# EAGLE design octanis_eps_v03 (EAGLE 7.1.0)
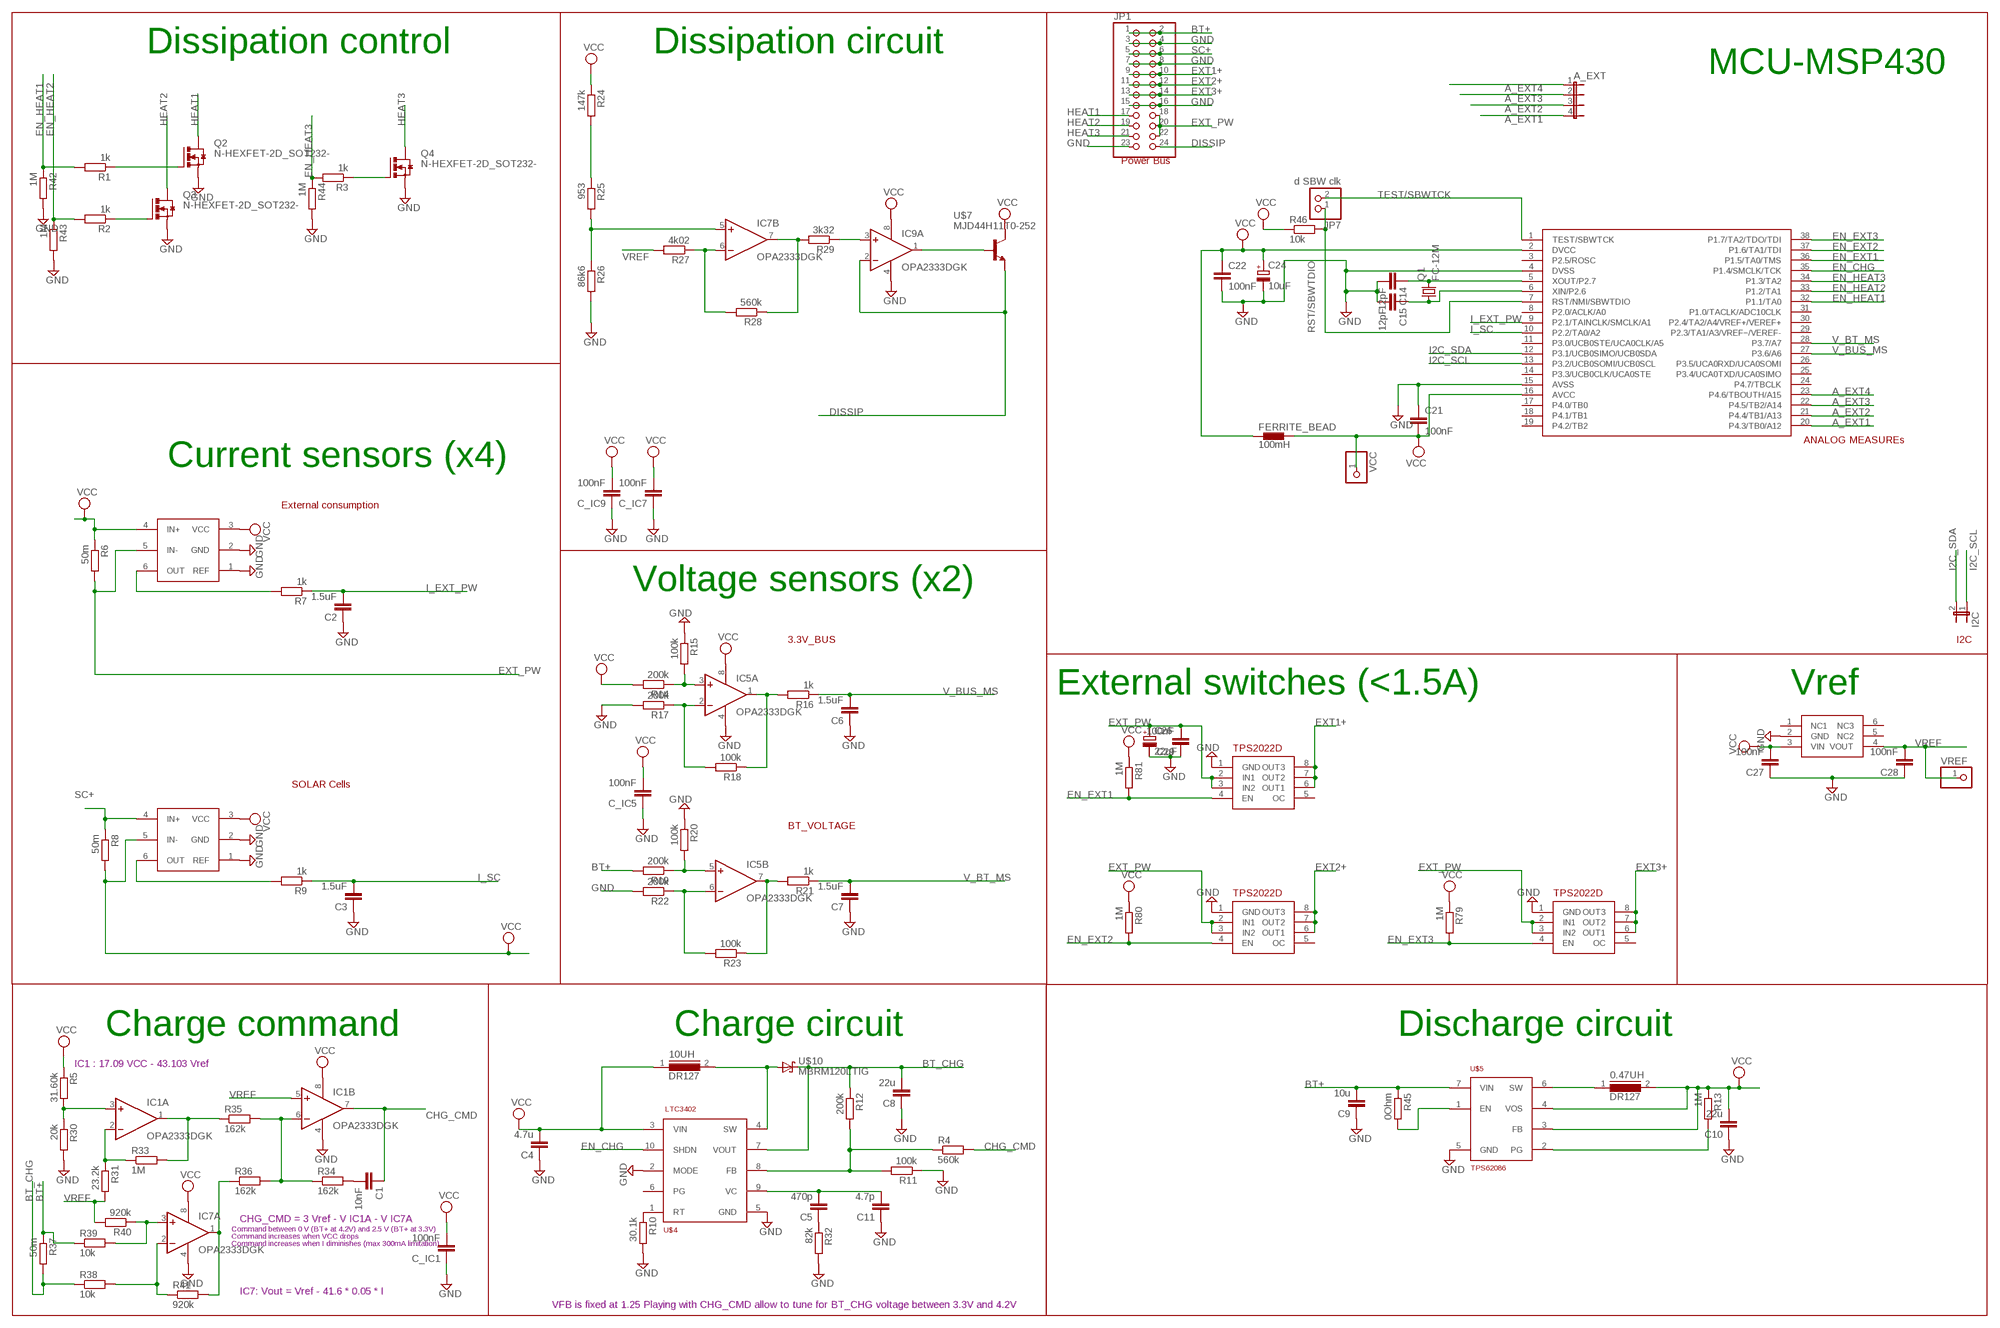
[diagram p0: schematic, sheet 1]

## Parts
0.47UH  DR127  [DR127]
10UH  DR127  [DR127]
A_EXT  JP4E  [JP4]
C1  10nF  C-EUC0603  [C0603]
C2  1.5uF  C-EUC0603  [C0603]
C3  1.5uF  C-EUC0603  [C0603]
C4  4.7u  C-EUC1206  [C1206]
C5  470p  C-EUC0603  [C0603]
C6  1.5uF  C-EUC0603  [C0603]
C7  1.5uF  C-EUC0603  [C0603]
C8  22u  C-EUC0603  [C0603]
C9  10u  C-EUC1206  [C1206]
C10  22u  C-EUC1206  [C1206]
C11  4.7p  C-EUC0603  [C0603]
C14  12pF  C-EUC0603  [C0603]
C15  12pF  C-EUC0603  [C0603]
C21  100nF  C-EUC0603  [C0603]
C22  100nF  C-EUC0603  [C0603]
C24  10uF  CPOL-EUA/3216-18R  [A/3216-18R]
C26  22uF  CPOL-EUA/3216-18R  [A/3216-18R]
C27  100nF  C-EUC0603  [C0603]
C28  100nF  C-EUC0603  [C0603]
C29  100nF  C-EUC0603  [C0603]
C_IC1  100nF  C-EUC0603  [C0603]
C_IC5  100nF  C-EUC0603  [C0603]
C_IC7  100nF  C-EUC0603  [C0603]
C_IC9  100nF  C-EUC0603  [C0603]
FERRITE_BEAD  100mH  BLM15HD601SN1  [0402]
I2C  JP1E  [JP1]
IC1  OPA2333DGK  [MSOP08]
IC5  OPA2333DGK  [MSOP08]
IC7  OPA2333DGK  [MSOP08]
IC9  OPA2333DGK  [MSOP08]
JP1  PINHD-2X12  [2X12]
JP7  d SBW clk  PINHD-1X2  [1X02]
Q1  FC-12M  [FC-12M]
Q2  N-HEXFET-2D_SOT232-  [SOT223]
Q3  N-HEXFET-2D_SOT232-  [SOT223]
Q4  N-HEXFET-2D_SOT232-  [SOT223]
R1  1k  R-EU_R0603  [R0603]
R2  1k  R-EU_R0603  [R0603]
R3  1k  R-EU_R0603  [R0603]
R4  560k  R-EU_R0603  [R0603]
R5  31.60k  R-EU_R0603  [R0603]
R6  50m  R-EU_R1206  [R1206]
R7  1k  R-EU_R0603  [R0603]
R8  50m  R-EU_R1206  [R1206]
R9  1k  R-EU_R0603  [R0603]
R10  30.1k  R-EU_R0603  [R0603]
R11  100k  R-EU_R0603  [R0603]
R12  200k  R-EU_R0603  [R0603]
R13  1M  R-EU_R0603  [R0603]
R14  200k  R-EU_R0603  [R0603]
R15  100k  R-EU_R0603  [R0603]
R16  1k  R-EU_R0603  [R0603]
R17  200k  R-EU_R0603  [R0603]
R18  100k  R-EU_R0603  [R0603]
R19  200k  R-EU_R0603  [R0603]
R20  100k  R-EU_R0603  [R0603]
R21  1k  R-EU_R0603  [R0603]
R22  200k  R-EU_R0603  [R0603]
R23  100k  R-EU_R0603  [R0603]
R24  147k  R-EU_R0603  [R0603]
R25  953  R-EU_R0603  [R0603]
R26  86k6  R-EU_R0603  [R0603]
R27  4k02  R-EU_R0603  [R0603]
R28  560k  R-EU_R0603  [R0603]
R29  3k32  R-EU_R0603  [R0603]
R30  20k  R-EU_R0603  [R0603]
R31  23.2k  R-EU_R0603  [R0603]
R32  82k  R-EU_R0603  [R0603]
R33  1M  R-EU_R0603  [R0603]
R34  162k  R-EU_R0603  [R0603]
R35  162k  R-EU_R0603  [R0603]
R36  162k  R-EU_R0603  [R0603]
R37  50m  R-EU_R1206  [R1206]
R38  10k  R-EU_R0603  [R0603]
R39  10k  R-EU_R0603  [R0603]
R40  920k  R-EU_R0603  [R0603]
R41  920k  R-EU_R0603  [R0603]
R42  1M  R-EU_R0603  [R0603]
R43  1M  R-EU_R0603  [R0603]
R44  1M  R-EU_R0603  [R0603]
R45  0Ohm  R-EU_R0603  [R0603]
R46  10k  R-EU_R0603  [R0603]
R79  1M  R-EU_R0603  [R0603]
R80  1M  R-EU_R0603  [R0603]
R81  1M  R-EU_R0603  [R0603]
U$2  INA213  [SC70-6]
U$3  INA213  [SC70-6]
U$4  LTC3402  [MSOP10]
U$5  TPS62086  [QFN-7]
U$6  MSP430G2544  [TSSOP38_MSPGXX44_SERIES]
U$7  MJD44H11T0-252  [TO252]
U$10  MBRM120LTIG  [DO216AA]
U$16  TPS2022D  [SO8]
U$17  TPS2022D  [SO8]
U$18  TPS2022D  [SO8]
U$19  ADR127B  [TSOT23-6]
VCC  PINHD-1X1  [1X01]
VREF  PINHD-1X1  [1X01]

## Nets
A_EXT1: A_EXT.4 U$6.20(P4.3/TB0/A12)
A_EXT2: A_EXT.3 U$6.21(P4.4/TB1/A13)
A_EXT3: A_EXT.2 U$6.22(P4.5/TB2/A14)
A_EXT4: A_EXT.1 U$6.23(P4.6/TBOUTH/A15)
BT+: C9.2 JP1.1 JP1.2 R19.2 R37.1 R39.1 R45.1 U$5.7(VIN)
BT_CHG: C8.2 R12.1 R37.2 R38.1 U$4.7(VOUT) U$10.C(K)
CHG_CMD: C1.1 IC1.7(B:OUT) R4.2
DISSIP: IC9.2(A:-IN) JP1.24 U$7.3(E)
EN_CHG: U$4.10(SHDN) U$6.35(P1.4/SMCLK/TCK)
EN_EXT1: R81.2 U$6.36(P1.5/TA0/TMS) U$16.4(EN)
EN_EXT2: R80.2 U$6.37(P1.6/TA1/TDI) U$17.4(EN)
EN_EXT3: R79.2 U$6.38(P1.7/TA2/TDO/TDI) U$18.4(EN)
EN_HEAT1: R1.2 R42.1 U$6.32(P1.1/TA0)
EN_HEAT2: R2.2 R43.1 U$6.33(P1.2/TA1)
EN_HEAT3: R3.2 R44.1 U$6.34(P1.3/TA2)
EXT1+: JP1.9 JP1.10 U$16.6(OUT1) U$16.7(OUT2) U$16.8(OUT3)
EXT2+: JP1.11 JP1.12 U$17.6(OUT1) U$17.7(OUT2) U$17.8(OUT3)
EXT3+: JP1.13 JP1.14 U$18.6(OUT1) U$18.7(OUT2) U$18.8(OUT3)
EXT_PW: C26.+ C29.2 JP1.18 JP1.20 JP1.22 R6.2 U$2.5(IN-) U$16.2(IN1) U$16.3(IN2) U$17.2(IN1) U$17.3(IN2) U$18.2(IN1) U$18.3(IN2)
GND: C2.1 C3.1 C4.1 C6.1 C7.1 C8.1 C9.1 C10.1 C11.1 C14.2 C15.2 C21.1 C22.2 C24.- C26.- C27.1 C28.1 C29.1 C_IC1.1 C_IC5.1 C_IC7.1 C_IC9.1 IC1.4(P:V-) IC5.4(P:V-) IC7.4(P:V-) IC9.4(P:V-) JP1.3 JP1.4 JP1.7 JP1.8 JP1.15 JP1.16 JP1.23 Q2.3(S) Q3.3(S) Q4.3(S) R10.2 R11.1 R15.1 R17.2 R20.1 R22.2 R26.2 R30.2 R32.2 R42.2 R43.2 R44.2 U$2.1(REF) U$2.2(GND) U$3.1(REF) U$3.2(GND) U$4.2(MODE) U$4.5(GND) U$5.5(GND) U$6.4(DVSS) U$6.15(AVSS) U$16.1(GND) U$17.1(GND) U$18.1(GND) U$19.2(GND)
HEAT1: JP1.17 Q2.2(D) Q2.4(D)
HEAT2: JP1.19 Q3.2(D) Q3.4(D)
HEAT3: JP1.21 Q4.2(D) Q4.4(D)
I2C_SCL: I2C.1 U$6.13(P3.2/UCB0SOMI/UCB0SCL)
I2C_SDA: I2C.2 U$6.12(P3.1/UCB0SIMO/UCB0SDA)
I_EXT_PW: C2.2 R7.1 U$6.9(P2.1/TAINCLK/SMCLK/A1)
I_SC: C3.2 R9.1 U$6.10(P2.2/TA0/A2)
N$1: R7.2 U$2.6(OUT)
N$2: R9.2 U$3.6(OUT)
N$3: R10.1 U$4.1(RT)
N$4: C5.1 R32.1
N$5: IC7.1(A:OUT) R36.1 R41.2
N$6: IC1.3(A:+IN) R5.2 R30.1
N$7: IC1.2(A:-IN) R31.1 R33.1
N$8: C5.2 C11.2 U$4.9(VC)
N$9: IC1.1(A:OUT) R33.2 R35.1
N$10: IC5.7(B:OUT) R21.2 R23.1
N$11: IC1.6(B:-IN) R34.1 R35.2 R36.2
N$12: IC5.1(A:OUT) R16.2 R18.1
N$13: IC5.2(A:-IN) R17.1 R18.2
N$14: IC5.3(A:+IN) R14.1 R15.2
N$15: IC5.6(B:-IN) R22.1 R23.2
N$16: IC5.5(B:+IN) R19.1 R20.2
N$17: IC7.2(A:-IN) R38.2 R41.1
N$18: R24.2 R25.1
N$19: IC7.5(B:+IN) R25.2 R26.1
N$20: IC7.6(B:-IN) R27.1 R28.2
N$21: IC7.7(B:OUT) R28.1 R29.2
N$22: IC9.3(A:+IN) R29.1
N$23: R4.1 R11.2 R12.2 U$4.8(FB)
N$24: 10UH.2 U$4.4(SW) U$10.A
N$25: R13.2 U$5.2(PG)
N$26: 0.47UH.1 U$5.6(SW)
N$27: C1.2 R34.2
N$28: IC7.3(A:+IN) R39.2 R40.1
N$29: Q2.1(G) R1.1
N$30: R45.2 U$5.1(EN)
N$31: Q3.1(G) R2.1
N$37: Q4.1(G) R3.1
N$45: IC9.1(A:OUT) U$7.1(B)
N$48: C14.1 Q1.2 U$6.5(XOUT/P2.7)
N$50: C15.1 Q1.1 U$6.6(XIN/P2.6)
RST/SBWTDIO: JP7.1 R46.2 U$6.7(RST/NMI/SBWTDIO)
SC+: JP1.5 JP1.6 R8.1 U$3.4(IN+)
TEST/SBWTCK: JP7.2 U$6.1(TEST/SBWTCK)
V_BT_MS: C7.2 R21.1 U$6.28(P3.7/A7)
V_BUS_MS: C6.2 R16.1 U$6.27(P3.6/A6)
VCC: 0.47UH.2 10UH.1 C4.2 C10.2 C21.2 C22.1 C24.+ C27.2 C_IC1.2 C_IC5.2 C_IC7.2 C_IC9.2 FERRITE_BEAD.1 FERRITE_BEAD.2 IC1.8(P:V+) IC5.8(P:V+) IC7.8(P:V+) IC9.8(P:V+) R5.1 R6.1 R8.2 R13.1 R14.2 R24.1 R46.1 R79.1 R80.1 R81.1 U$2.3(VCC) U$2.4(IN+) U$3.3(VCC) U$3.5(IN-) U$4.3(VIN) U$5.3(FB) U$5.4(VOS) U$6.2(DVCC) U$6.16(AVCC) U$7.2(C) U$19.3(VIN) VCC.1
VREF: C28.2 IC1.5(B:+IN) R27.2 R31.2 R40.2 U$19.4(VOUT) VREF.1
Unconnected: IC9.5(B:+IN) IC9.6(B:-IN) IC9.7(B:OUT) U$4.6(PG) U$6.3(P2.5/ROSC) U$6.8(P2.0/ACLK/A0) U$6.11(P3.0/UCB0STE/UCA0CLK/A5) U$6.14(P3.3/UCB0CLK/UCA0STE) U$6.17(P4.0/TB0) U$6.18(P4.1/TB1) U$6.19(P4.2/TB2) U$6.24(P4.7/TBCLK) U$6.25(P3.4/UCA0TXD/UCA0SIMO) U$6.26(P3.5/UCA0RXD/UCA0SOMI) U$6.29(P2.3/TA1/A3/VREF−/VEREF-) U$6.30(P2.4/TA2/A4/VREF+/VEREF+) U$6.31(P1.0/TACLK/ADC10CLK) U$16.5(OC) U$17.5(OC) U$18.5(OC) U$19.1(NC1) U$19.5(NC2) U$19.6(NC3)

## Notes on the sheet
- Dissipation control | Dissipation circuit
- MCU-MSP430
- Power Bus
- ANALOG MEASUREs
- Current sensors (x4)
- External consumption
- Voltage sensors (x2)
- 3.3V_BUS | I2C
- External switches (<1.5A) | Vref
- SOLAR Cells
- BT_VOLTAGE
- Charge command | Charge circuit | Discharge circuit
- IC1 : 17.09 VCC - 43.103 Vref
- CHG_CMD = 3 Vref - V IC1A - V IC7A
- Command between 0 V (BT+ at 4.2V) and 2.5 V (BT+ at 3.3V)
- Command increases when VCC drops
- Command increases when I diminishes (max 300mA limitation)
- IC7: Vout = Vref - 41.6 * 0.05 * I
- VFB is fixed at 1.25 Playing with CHG_CMD allow to tune for BT_CHG voltage between 3.3V and 4.2V

## Library data of the parts
0.47UH 10UH = inductors:DR127: High Power Density, High Efficiency, Shielded Inductors Source: coiltronics_dr_series.pdf
A_EXT = jumper:JP4E: JUMPER
C1-C11 C14 C15 C21 C22 C27-C29 C_IC1 C_IC5 C_IC7 C_IC9 = rcl:C-EU: CAPACITOR, European symbol
C24 C26 = rcl:CPOL-EU: POLARIZED CAPACITOR, European symbol
FERRITE_BEAD = inductors:BLM15H: EMIFIL (R) Chip Ferrite Bead for GHz Noise Source: http://www.murata.com/ Ferrite Bead BLM15H.pdf
I2C = jumper:JP1E: JUMPER
IC1 IC5 IC7 IC9 = linear:OPA2333: DUAL 1.8V, microPOWER CMOS OPERATIONAL AMPLIFIERS Zerø-Drift Series Source: Texas Instruments (Burr-Brown) .. U11 opa333 Operational Amp.pdf
JP1 = pinhead:PINHD-2X12: PIN HEADER
JP7 = pinhead:PINHD-1X2: PIN HEADER
Q1 = crystal:FC-12M: kHz RANGE CRYSTAL UNIT LOW PROFILE SMD Source: Epson Toyocom FC-12M.pdf
Q2-Q4 = transistor-power:N-HEXFET-2D_?-*: HEXFET® Power MOSFET 2 Drain connects http://www.irf.com/product-info/datasheets/data/irll014n.pdf
R1-R46 R79-R81 = rcl:R-EU_: RESISTOR, European symbol
U$2 U$3 = Octanis1_EPS:INA213: Voltage Output, High or Low Side Measurement, Bi-Directional Zer ø -Drift Series Current-Shunt Monitor
U$4 = Octanis1_EPS:LTC3402: 1 LTC3402 3402fb 2A, 3MHz Micropower Synchronous Boost Converter
U$5 = Octanis1_EPS:TPS62086: 3-A Step-Down Converter with Hiccup Short Circuit Protection in 2x2 QFN Package Fixed 3.3V operation
U$6 = Octanis1_EPS:MSP430G2544: MSP430G2x44 Mixed-Signal Microcontrollers
U$7 = Octanis1_EPS:MJD44H11: MJD44H11, MJD45H11 Complementary power transistors
U$10 = Octanis1_EPS:MBRM120LTIG
U$16-U$18 = Octanis1_EPS:TPS2022D: TEXAS INSTRUMENTS - TPS2022D - IC, 1.5A PWR DIST SWITCH 8SOIC
U$19 = Octanis1_EPS:ADR127B: ANALOG DEVICES - ADR127BUJZ-REEL7 - VOLTAGE REFERENCE, SERIES, 3.3V, TSOT-6
VCC VREF = pinhead:PINHD-1X1: PIN HEADER

## Net classes
0 default: clearance 0.205 mm

## Board
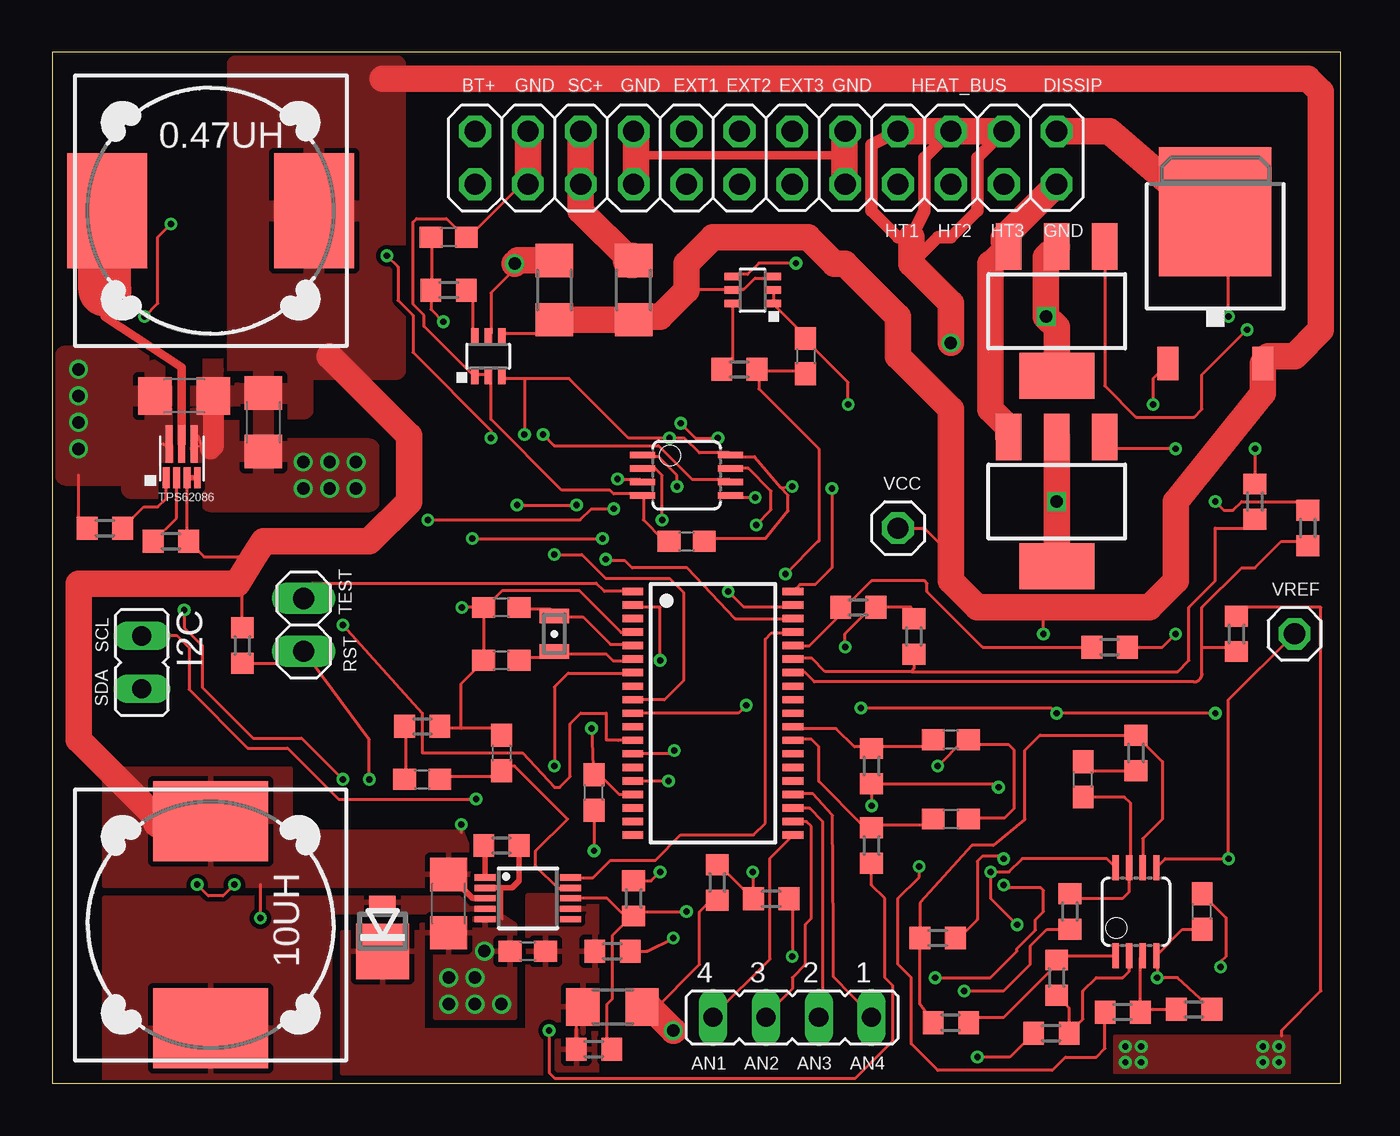
[diagram p1: board, top side]
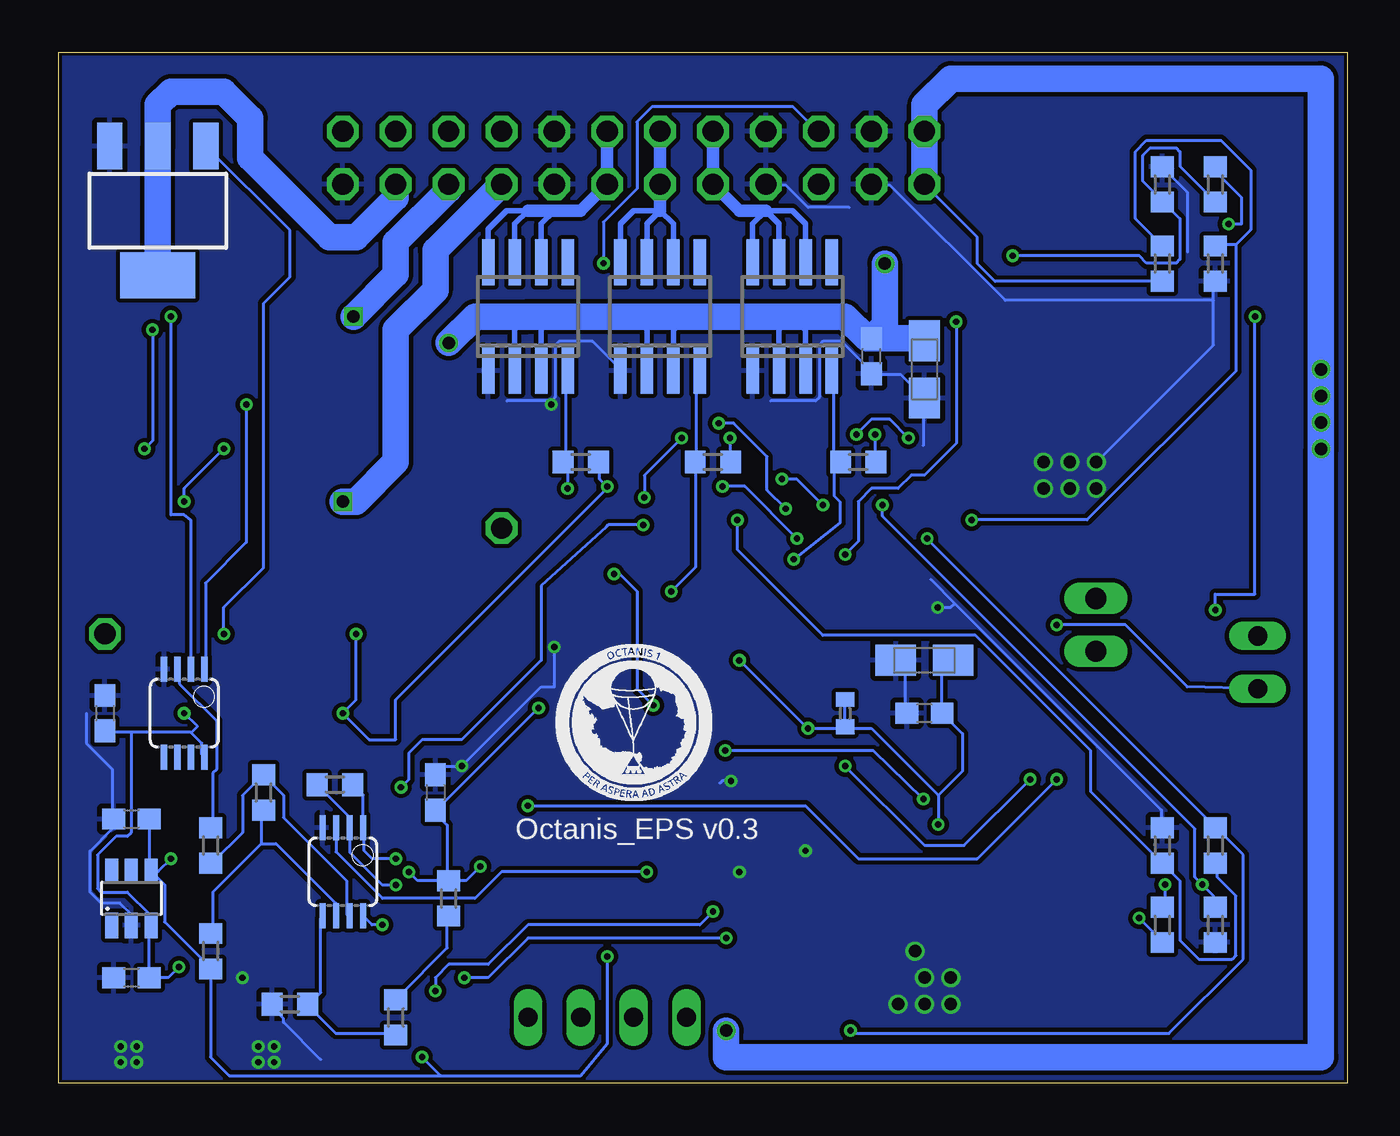
[diagram p2: board, bottom side, seen from below]

Size 61.9 x 49.52 mm. Coordinates in mm from the lower left corner, seen from the top.
Outline: 0,0 61.9,0 61.9,49.52 0,49.52 0,0
Copper layers (1*2*15*16): Top 0.035mm / dielectric 0.2mm / layer 2 0.0175mm / dielectric 1.1mm / layer 15 0.0175mm / dielectric 0.2mm / Bottom 0.035mm
Design rules "SeeedStudio_DRU_no_angle_20130527 *": minimum track width 6mil, minimum drill 12mil, track to track 6mil, track to pad 6mil, pad to pad 6mil, via to via 6mil, smd to smd 0mil, copper to edge 6mil, drill to drill 6mil, minimum pad ring 6mil, minimum via ring 6mil, stop-mask expansion 2mil, vias tented up to drill 25mil, thermal gap 10mil

### Footprints (pad centres in the part's own frame; a part is rotated, then mirrored left to right if it is on the bottom)
DR127 = smd 3.85 x 5.5: 1 -4.975,0; 2 4.975,0
JP4 = drill 0.914 long: 1 -3.81,0; 2 -1.27,0; 3 1.27,0; 4 3.81,0
C0603 = smd 1.1 x 1: 1 -0.85,0; 2 0.85,0
C1206 = smd 1.6 x 1.8: 1 -1.4,0; 2 1.4,0
A/3216-18R = smd 1.95 x 1.5: + 1.375,0; - -1.375,0
0402 = smd 0.7 x 0.9: 1 -0.65,0; 2 0.65,0
JP1 = drill 0.914 long: 1 0,-1.27; 2 0,1.27
MSOP08 = smd 0.3 x 1.2: 1 -0.976,-2.113; 2 -0.326,-2.113; 3 0.324,-2.113; 4 0.974,-2.113; 5 0.974,2.112; 6 0.324,2.112; 7 -0.326,2.112; 8 -0.976,2.112
2X12 = drill 1.016 octagon: 1 -13.97,-1.27; 2 -13.97,1.27; 3 -11.43,-1.27; 4 -11.43,1.27; 5 -8.89,-1.27; 6 -8.89,1.27; 7 -6.35,-1.27; 8 -6.35,1.27; 9 -3.81,-1.27; 10 -3.81,1.27; 11 -1.27,-1.27; 12 -1.27,1.27; 13 1.27,-1.27; 14 1.27,1.27; 15 3.81,-1.27; 16 3.81,1.27; 17 6.35,-1.27; 18 6.35,1.27; 19 8.89,-1.27; 20 8.89,1.27; 21 11.43,-1.27; 22 11.43,1.27; 23 13.97,-1.27; 24 13.97,1.27
1X02 = drill 1.016 long: 1 -1.27,0; 2 1.27,0
FC-12M = smd 0.7 x 1.4: 1 -0.85,0; 2 0.85,0
SOT223 = smd 1.219 x 2.235: 1 -2.311,-3.099; 2 0,-3.099; 3 2.311,-3.099 | smd 3.6 x 2.2: 4 0,3.099
R0603 = smd 1 x 1.1: 1 -0.85,0; 2 0.85,0
R1206 = smd 1.6 x 1.803: 1 -1.422,0; 2 1.422,0
SC70-6 = smd 0.35 x 0.8: 1 -0.65,-0.95; 2 0,-0.95; 3 0.65,-0.95; 4 0.65,0.95; 5 0,0.95; 6 -0.65,0.95
MSOP10 = smd 0.3 x 1: 1 -1,-2.05; 2 -0.5,-2.05; 3 0,-2.05; 4 0.5,-2.05; 5 1,-2.05; 6 1,2.05; 7 0.5,2.05; 8 0,2.05; 9 -0.5,2.05; 10 -1,2.05
QFN-7 = smd 0.33 x 1.016: 1 1.501,0.127; 2 1.001,0.127; 3 0.5,0.127; 4 0,0.127 | smd 0.33 x 1.778: 5 0.15,-1.499; 6 0.749,-1.499; 7 1.349,-1.499
TSSOP38_MSPGXX44_SERIES = smd 0.35 x 1: 1 -5.85,-3.85; 2 -5.2,-3.85; 3 -4.55,-3.85; 4 -3.9,-3.85; 5 -3.25,-3.85; 6 -2.6,-3.85; 7 -1.95,-3.85; 8 -1.3,-3.85; 9 -0.65,-3.85; 10 0,-3.85; 11 0.65,-3.85; 12 1.3,-3.85; 13 1.95,-3.85; 14 2.6,-3.85; 15 3.25,-3.85; 16 3.9,-3.85; 17 4.55,-3.85; 18 5.2,-3.85; 19 5.85,-3.85; 20 5.85,3.85; 21 5.2,3.85; 22 4.55,3.85; 23 3.9,3.85; 24 3.25,3.85; 25 2.6,3.85; 26 1.95,3.85; 27 1.3,3.85; 28 0.65,3.85; 29 0,3.85; 30 -0.65,3.85; 31 -1.3,3.85; 32 -1.95,3.85; 33 -2.6,3.85; 34 -3.25,3.85; 35 -3.9,3.85; 36 -4.55,3.85; 37 -5.2,3.85; 38 -5.85,3.85
TO252 = smd 1 x 1.6: 1 -2.28,-4.8; 2 2.28,-4.8 | smd 5.4 x 6.2: 3 0,2.5
DO216AA = smd 0.635 x 1.27: A 2.349,0 | smd 2.667 x 2.54: C -0.01,0
SO8 = smd 0.6 x 2.2: 1 -1.905,-2.6; 2 -0.635,-2.6; 3 0.635,-2.6; 4 1.905,-2.6; 5 1.905,2.6; 6 0.635,2.6; 7 -0.635,2.6; 8 -1.905,2.6
TSOT23-6 = smd 0.62 x 1.22: 1 -0.95,-1.3; 2 0,-1.3; 3 0.95,-1.3; 4 0.95,1.3; 5 0,1.3; 6 -0.95,1.3
1X01 = drill 1.016 octagon: 1 0,0

### Placement (x,y rotation side)
0.47UH  7.62,41.91 0 top
10UH  7.62,7.62 270 top
A_EXT  35.56,3.18 180 top
C1  49.53,14.61 90 top
C2  19.05,40.64 180 top
C3  36.2,34.92 270 top
C4  19.05,8.64 90 top
C5  17.78,14.61 0 top
C6  43.18,12.7 180 top
C7  43.18,16.51 180 top
C8  22.86,6.35 0 top
C9  6.35,33.02 180 top
C10  10.16,31.75 90 top
C11  21.59,15.87 270 top
C14  21.59,22.86 180 top
C15  21.59,20.32 180 top
C21  26.04,13.97 90 top
C22  20.32,17.78 180 bottom
C24  20.32,20.32 0 bottom
C26  20.32,34.29 90 bottom
C27  58.42,5.08 0 bottom
C28  58.42,12.7 0 bottom
C29  22.86,34.92 90 bottom
C_IC1  55.24,8.25 90 top
C_IC5  30.48,26.04 0 top
C_IC7  43.81,13.97 270 bottom
C_IC9  59.69,17.78 270 bottom
FERRITE_BEAD  24.13,17.78 270 bottom
I2C  4.32,20.22 180 top
IC1  52.07,8.25 0 top
IC5  30.48,29.21 270 top
IC7  48.26,10.16 180 bottom
IC9  55.88,17.78 180 bottom
JP1  34.29,44.45 0 top
JP7  12.09,22.02 90 top
Q1  24.13,21.59 90 top
Q2  48.26,27.94 180 top
Q3  48.26,37.08 180 top
Q4  57.15,41.91 180 bottom
R1  60.33,26.67 270 top
R2  57.78,27.94 270 top
R3  50.8,20.96 180 top
R4  48.9,8.25 90 top
R5  51.44,3.43 0 top
R6  24.13,38.1 90 top
R7  19.05,38.1 0 top
R8  27.94,38.1 270 top
R9  33.02,34.29 180 top
R10  21.59,11.43 0 top
R11  27.94,8.89 270 top
R12  26.04,1.65 0 top
R13  5.71,26.04 180 top
R14  8.89,7.62 270 bottom
R15  6.35,7.62 90 bottom
R16  39.37,11.43 270 top
R17  8.89,11.43 90 bottom
R18  6.35,11.43 270 bottom
R19  8.89,39.37 270 bottom
R20  6.35,39.37 90 bottom
R21  39.37,15.24 270 top
R22  8.89,43.18 90 bottom
R23  6.35,43.18 270 bottom
R24  43.18,8.89 270 bottom
R25  45.72,3.18 270 bottom
R26  50.8,3.81 180 bottom
R27  54.61,6.35 270 bottom
R28  52.07,13.97 270 bottom
R29  54.61,11.43 270 bottom
R30  54.86,3.56 0 top
R31  48.01,2.41 180 top
R32  17.78,17.14 0 top
R33  48.26,5.08 90 top
R34  52.07,15.87 270 top
R35  43.18,2.92 180 top
R36  42.55,6.99 180 top
R37  26.92,3.68 180 top
R38  26.92,6.35 0 top
R39  31.95,9.65 90 top
R40  34.54,8.86 0 top
R41  48.64,14.35 0 bottom
R42  56.9,21.59 90 top
R43  41.4,21.46 90 top
R44  38.73,22.86 0 top
R45  2.54,26.67 0 top
R46  9.14,21.03 270 top
R79  36.83,29.85 180 bottom
R80  30.48,29.85 180 bottom
R81  23.5,29.85 180 bottom
U$2  20.95,34.92 0 top
U$3  33.66,38.1 90 top
U$4  22.86,8.89 270 top
U$5  6.99,29.21 180 top
U$6  31.75,17.78 270 top
U$7  55.88,39.37 0 top
U$10  15.88,6.35 90 top
U$16  26.67,36.83 0 bottom
U$17  33.02,36.83 0 bottom
U$18  39.37,36.83 0 bottom
U$19  58.42,8.89 0 bottom
VCC  40.64,26.67 0 top
VREF  59.69,21.59 0 top

### Tracks (layer width: path | path; a pad name or v marks a point on that pad's centre or on a via)
A_EXT1
  Top 0.152: A_EXT.4 31.81,3.29 34.49,5.97 34.49,10.82 U$6.20
A_EXT2
  Top 0.152: A_EXT.3 34.31,3.29 35.56,4.54 35.56,5.08 36.2,5.71 36.2,7.64 36.47,7.93 36.47,12.34 36.25,12.57 U$6.21
A_EXT3
  Top 0.152: U$6.22 35.62,13.21 36.4,13.21 37.01,12.6 37.01,3.35 A_EXT.2
A_EXT4
  Top 0.152: A_EXT.1 39.31,3.29 37.53,5.13 37.53,7.25 37.49,12.88 36.55,13.92 35.64,13.92 U$6.23
BT+  (via drill 0.6)
  Top 0.152: 5.72,30.64 U$5.7 5.71,30.48 5.32,30.71 | R37.1 28.35,4.22 | R45.1 1.27,27.09 1.27,29.21 | 28.89,3.49 31.11,5.71 31.11,8.25 31.75,8.89 R39.1
  Top 1.27: v29.84,2.54 28.89,3.49 28.7,3.68 R37.1
  Bottom 0.152: R19.2 16.93,38.52 17.78,39.37 17.78,40.64 JP1.1
  Bottom 1.016: JP1.1 JP1.2
  Bottom 1.27: JP1.1 20.32,46.99 19.05,48.26 1.27,48.26 v1.27,33.02 v1.27,31.75 v1.27,30.48 1.27,1.27 29.84,1.27 v29.84,2.54
  other vias: 1.27,34.29
  pour Top: 0.64,29.21 3.81,29.21 3.81,28.57 5.71,28.57 5.71,33.66 4.45,34.92 0.64,34.92
BT_CHG
  Top 0.152: R12.1 25.18,3.37 R37.2
  pour Top: 13.97,7.24 17.78,7.24 17.78,2.54 22.86,2.54 22.86,9.02 26.16,9.02 26.16,0.51 13.97,0.51
CHG_CMD
  Top 0.152: C1.1 51.52,13.75 51.82,13.46 51.82,10.44 IC1.7 51.74,9.2 51.44,8.89 49.11,8.89 R4.2
DISSIP  (via drill 0.3)
  Top 0.152: v56.52,36.83 56.52,40 U$7.3
  Top 1.27: U$7.3 55.28,41.87 50.8,45.72 JP1.24
  Bottom 0.152: IC9.2 55.58,19.91 55.58,27.06 55.88,27.3 56.52,27.3 v56.52,36.83
EN_CHG
  Top 0.152: U$4.10 25.99,9.89 26.82,10.72 28.98,10.72 30.2,11.94 33.71,11.94 34.27,12.5 34.27,21.34 34.57,21.64 35.56,21.64 U$6.35
EN_EXT1  (via drill 0.3)
  Top 0.152: U$6.36 32.82,22.33 30.5,24.76 27.86,24.76 27.53,25.1 26.67,25.1 v26.59,25.17
  Bottom 0.152: 24.66,30.1 24.66,34.21 U$16.4 | 24.66,30.1 24.48,29.92 R81.2 | 24.66,30.1 24.66,28.22 24.38,27.94 24.38,26.92 v26.59,25.17
EN_EXT2  (via drill 0.3)
  Top 0.152: v32.49,23.62 33.22,22.89 35.51,22.89 U$6.37
  Bottom 0.152: U$17.4 31.27,34.21 31.27,29.92 R80.2 31.33,24.78 v32.49,23.62
EN_EXT3  (via drill 0.3)
  Top 0.152: v37.47,28.57 37.47,24.76 36.65,23.95 35.92,23.95 U$6.38
  Bottom 0.152: U$18.4 37.53,34.21 37.53,29.92 R79.2 37.47,29.85 v37.47,28.57
EN_HEAT1
  Top 0.152: 55.24,20.96 55.24,19.68 arc-90 54.84,19.28 36.62,19.28 36.17,19.74 U$6.32 | 55.24,20.96 55.24,22.86 57.15,24.76 57.78,24.76 59.05,26.04 60.11,26.04 R1.2 | 55.24,20.96 56.52,20.96 R42.1
EN_HEAT2
  Top 0.152: 41.27,19.78 54.07,19.78 54.61,20.32 54.61,22.86 55.88,24.13 55.88,26.67 57.37,26.67 R2.2 | R43.1 41.4,19.91 41.27,19.78 | 41.27,19.78 37.14,19.78 36.5,20.42 35.64,20.42 U$6.33
EN_HEAT3
  Top 0.152: R3.2 44.7,20.96 42.04,23.62 42.04,24 41.91,24.13 39.37,24.13 38.1,22.86 R44.1 37.88,22.52 36.37,21.01 35.62,21.01 U$6.34
EXT1+
  Bottom 0.254: U$16.7 27.3,41.27 27.94,41.91 | U$16.8 28.57,41.27 27.94,41.91 | U$16.6 26.04,41.27 26.67,41.91 27.94,41.91
  Bottom 0.61: JP1.10 JP1.9 29.21,41.91 27.94,41.91
EXT2+
  Bottom 0.254: U$17.6 32.38,41.27 33.02,41.91 | U$17.7 33.66,41.27 33.02,41.91 | U$17.8 34.92,41.27 34.29,41.91 33.02,41.91
  Bottom 0.61: JP1.12 JP1.11 33.02,41.91
EXT3+
  Bottom 0.254: U$18.6 38.73,41.27 38.1,41.91 | U$18.7 40.01,41.27 39.37,41.91 40.39,41.91 41.27,41.02 U$18.8
  Bottom 0.61: JP1.14 JP1.13 36.83,41.91 38.1,41.91 39.37,41.91
EXT_PW  (via drill 0.6)
  Top 0.152: U$2.5 21.09,36 21.09,37.96 21.98,38.86 v22.23,39.37
  Top 0.61: JP1.22 44.45,44.45 44.45,41.91 43.18,40.64 42.55,40.64 41.27,39.37 | JP1.20 41.91,44.45 41.91,41.91 41.27,40.64 40.64,40.64 39.37,41.91 39.37,45.08 JP1.18
  Top 1.27: R6.2 22.38,39.52 v22.23,39.37 | JP1.18 JP1.20 JP1.22 | 41.27,40.64 41.27,39.37 43.18,37.46 v43.18,35.56
  Bottom 0.254: U$16.3 26.04,36.19 26.67,36.83 27.3,36.19 U$16.2 | U$17.3 32.38,36.19 31.75,36.83 | U$17.2 33.66,36.19 34.29,36.83 | U$18.3 38.73,36.19 38.1,36.83 | U$18.2 40.01,36.19 39.37,36.83
  Bottom 1.27: C29.2 20.43,35.77 C26.+ | C29.2 23.07,35.77 24.13,36.83 26.67,36.83 31.75,36.83 34.29,36.83 38.1,36.83 39.37,36.83 41.91,36.83 v43.18,35.56 | v22.23,39.37 22.23,36.41 C29.2
GND  (via drill 0.3, 0.6)
  Top 0.152: 28.06,43.32 JP1.7 | 28.06,45.65 JP1.8 | 22.87,45.65 JP1.4 | 22.87,43.32 JP1.3 22.7,43.32 20.01,40.64 C2.1 19.84,40.64 18.94,41.54 17.51,41.54 17.33,41.36 17.33,37.43 17.87,36.89 17.87,36.35 20.19,34.03 U$2.1 20.37,34.03 20.91,34.03 U$2.2 21.09,33.85 21.09,31.89 24.48,28.49 26.8,28.49 26.98,28.31 28.23,28.31 IC5.4 28.41,28.13 28.41,27.06 29.31,26.17 29.48,26.17 C_IC5.1 29.66,25.99 29.84,25.81 | C14.2 20.73,22.77 20.73,20.45 C15.2 20.73,20.27 19.66,19.2 19.66,17.05 | 19.66,17.05 21.27,17.05 21.44,16.87 C11.1 | 19.66,17.05 18.76,17.05 R32.2 | C14.2 20.91,22.95 21.62,23.67 25.33,23.67 27.33,21.67 27.89,21.67 U$6.4 | 7.15,30.61 6.97,30.64 U$5.5 6.99,31.11 7.15,30.71 | 7.86,30.1 7.62,30.48 | C6.1 44.14,12.76 45.78,12.76 46.23,13.21 46.23,16 45.97,16.26 44.28,16.26 C7.1 43.81,16.51 v42.55,15.24 | 21.62,7.89 21.62,9.39 | U$3.2 34.67,37.96 34.67,37.6 U$3.1 34.67,37.43 36.28,35.82 C3.1 36.28,35.64 38.24,33.67 v38.24,32.6 | R11.1 27.88,9.73 28.78,9.73 v29.21,10.16 | C21.1 v26.04,11.18 | 55.24,7.62 C_IC1.1 54.31,7.4 IC1.4 53.09,6.1 v53.09,5.08 54.06,5.08 R30.2 | C14.2 v19.68,22.86 | R43.2 41.27,22.22 41.27,22.86 R44.2 39.37,22.86 38.1,21.59 v38.1,20.96 | R42.2 57.15,22.86 60.96,22.86 60.96,4.44 59.05,2.54 59.05,2.29 | U$6.15 v29.62,14.53
  Top 0.254: R10.2 22.44,9.74 22.09,9.39 21.62,9.39 U$4.2
  Top 0.406: 28.06,44.57 38.06,44.57
  Top 0.61: 38.06,44.45 38.06,44.2
  Top 1.016: C9.1 7.75,30.61 7.62,30.48
  Top 1.27: 38.06,45.65 38.06,44.57 38.06,44.2 38.06,43.32 | 28.06,45.65 28.06,44.57 28.06,43.32 | 22.87,43.32 22.87,45.65 | Q2.3 45.95,31.52 45.09,32.39 45.09,39.37 45.14,39.37 Q3.3 45.72,40.41 45.72,40.64 JP1.23
  Bottom 0.152: 23.95,42.07 25.91,42.07 26.98,43.14 27.88,43.14 JP1.7 | 22.87,43.14 JP1.3 22.7,43.14 21.98,43.14 16.44,37.6 6.43,37.6 | 7.68,39.93 7.68,42.79 8.76,43.86 R22.2 | 6.43,38.68 R20.1 6.43,38.5 6.43,37.6 | 20.37,30.64 20.37,32.78 C26.- 20.37,32.96 21.44,34.03 22.7,34.03 C29.1 22.87,34.21 24.3,35.64 25.2,35.64 25.38,35.46 25.38,32.96 25.55,32.78 27.7,32.78 | 14.65,29.92 v14.61,29.85 | 28.41,33.5 28.41,34.21 U$16.1 | 20.01,24.2 18.86,23.05 | 18.86,23.05 8.94,13.12 8.94,12.41 R17.2 | 6.43,37.6 6.43,35.46 11.97,29.92 v12.06,29.85 | 60.58,17.77 60.58,16.34 59.33,15.09 59.33,12.76 C28.1 59.33,12.59 59.33,12.23 60.4,11.16 60.4,9.19 59.86,8.65 58.97,8.65 58.44,8.12 58.44,7.76 U$19.2 | 59.86,18.48 C_IC9.1 | 41.1,33.5 41.1,34.21 U$18.1 | 38.24,32.78 40.39,32.78 | 38.24,32.78 38.06,32.96 38.06,35.46 37.88,35.64 36.28,35.64 35.02,34.39 U$17.1 | 38.24,32.78 v38.24,32.6 | 21.8,20.45 C24.- 21.62,20.27 21.27,19.91 21.27,17.95 C22.2 21.09,17.77 | 20.73,6.51 v20.78,6.35 | 49.32,1.15 51.11,2.94 51.11,3.12 51.64,3.65 R26.2 | 21.62,3.65 v21.59,3.81 | C_IC7.1 43.81,15.24 v42.55,15.24 38.73,19.05 38.1,19.05 v38.1,20.96 | v53.09,5.08 53.34,5.08 | v19.68,22.86 19.05,22.86 18.86,23.05 | v29.62,14.53 30.02,14.53 30.12,14.43 30.15,14.43
  other vias: 13.34,29.85 12.06,28.57 13.34,28.57 19.05,5.08 19.05,3.81 20.32,3.81 20.32,5.08 51.56,1.78 51.56,1.02 52.32,1.78 52.32,1.02 58.17,1.78 58.17,1.02 58.93,1.78 58.93,1.02 14.61,28.57
  pour Top: 6.35,34.29 7.62,27.94 15.24,27.94 15.24,30.48 11.43,30.48 11.43,34.29
  pour Top: 22.23,7.62 22.23,3.18 18.41,3.18 18.41,6.35 17.78,6.99 17.78,7.62 20.32,7.62 20.32,8.89
  pour Bottom: -1.27,49.53 63.5,49.53 62.23,-1.27 -1.27,-1.27
  pour Top: 51.56,2.29 59.44,2.29 59.44,2.03 59.44,0.51 51.05,0.51 51.05,1.27 51.05,2.29
HEAT1  (via drill 0.6)
  Top 1.27: Q2.2 v48.26,27.94 Q2.4
  Bottom 1.27: JP1.17 43.81,40 43.81,38.1 45.72,36.19 45.72,29.85 47.62,27.94 v48.26,27.94
HEAT2  (via drill 0.6)
  Top 1.27: Q3.2 47.75,39.67 v47.75,36.83 48.26,36.32 Q3.4
  Bottom 1.27: JP1.19 43.18,42.93 45.72,40.39 45.72,38.86 v47.75,36.83
HEAT3
  Bottom 1.27: JP1.21 45.72,42.55 47.62,40.64 48.9,40.64 52.7,44.45 52.7,46.35 53.98,47.62 56.52,47.62 57.15,46.99 Q4.2 Q4.4
I2C_SCL  (via drill 0.3)
  Top 0.152: v20.37,13.66 13.76,13.66 11.31,16.1 9.4,16.1 6.58,18.92 6.58,20.93 5.99,21.52 4.29,21.52 I2C.1 | v29.89,15.98 29.73,15.83 U$6.13
  Bottom 0.152: v20.37,13.66 22.77,15.98 v29.89,15.98
I2C_SDA  (via drill 0.3)
  Top 0.152: v13.97,22.02 17.78,17.78 17.78,15.87 22.61,15.87 24.13,14.22 24.38,14.22 24.89,14.73 24.89,17.27 25.4,17.78 26.62,17.78 26.62,16.49 27.21,16.48 U$6.12
  Bottom 0.152: I2C.2 7.7,19.05 10.67,22.02 v13.97,22.02
I_EXT_PW  (via drill 0.3)
  Top 0.152: C2.2 18.23,40.46 18.23,38.14 R7.1 18.2,37.17 v18.8,36.58 | v24.13,25.4 25.45,25.4 26.59,24.26 29.67,24.26 30.33,23.6 30.33,19.33 29.41,18.42 27.91,18.42 U$6.9
  Bottom 0.152: v18.8,36.58 18.8,30.73 20.32,29.21 20.95,29.21 21.59,28.57 22.86,28.57 23.5,27.94 23.5,26.04 v24.13,25.4
I_SC  (via drill 0.3)
  Top 0.152: 33.95,34.21 36.1,34.21 C3.2 | 33.95,34.21 R9.1 | 33.95,34.21 33.95,33.36 36.83,30.48 36.83,26.04 36.8,26.04 v35.23,24.46 | v33.35,18.16 32.97,17.78 U$6.10
  Bottom 0.152: v35.23,24.46 34.95,24.46 34.14,23.65 34.14,18.95 v33.35,18.16
N$1
  Top 0.152: U$2.6 20.19,36 20.19,37.78 20.01,37.96 R7.2
N$2
  Top 0.152: U$3.6 32.7,37.43 32.7,34.74 32.34,34.39 R9.2
N$3
  Top 0.254: U$4.1 20.81,11.36 R10.1
N$4
  Top 0.152: C5.1 16.98,14.73 16.98,17.05 R32.1
N$5  (via drill 0.3)
  Top 0.152: v45.72,10.79 45.59,10.92 44.7,10.92 44.45,10.67 44.45,7.87 43.56,6.99 R36.1
  Bottom 0.152: R41.2 47.28,13.84 IC7.1 47.24,12.23 47.24,11.18 46.86,10.79 v45.72,10.79
N$6
  Top 0.152: IC1.3 52.28,6.03 R5.2 52.67,3.56 R30.1
N$7
  Top 0.152: IC1.2 51.74,5.39 51.44,5.08 50.16,5.08 49.53,4.44 49.53,3.09 R31.1 48.86,3.63 R33.1
N$8
  Top 0.152: U$4.9 24.84,9.37 24.3,9.37 23.23,10.44 23.23,11.17 24.77,12.7 22.23,15.24 21.8,15.24 C11.2 | 21.62,14.91 C11.2 | C5.2 18.76,14.73 21.27,14.73 21.44,14.91 C11.2
N$9
  Top 0.152: IC1.1 48.47,6.14 R33.2 48.26,5.71 45.72,3.18 44.28,3.18 R35.1
N$10  (via drill 0.3)
  Top 0.152: v5.71,41.27 5.08,40.64 5.08,37.46 v4.45,36.83 | v39.37,13.33 R21.2 45.3,14.39 v45.47,14.22 | v33.83,26.82 34.54,27.56 34.54,28.45 33.46,29.54 IC5.7 | v6.35,22.73 6.35,21.89 7.21,21.03 7.21,19.03 9.65,16.59 11.99,16.59 v13.97,14.61
  Bottom 0.152: v5.71,41.27 5.08,41.27 5.08,42.55 6.35,43.81 R23.1 | v4.45,36.83 4.45,23.5 6.35,23.5 v6.35,22.73 | v13.97,14.61 17.78,10.79 23.5,10.79 26.04,13.33 v39.37,13.33 | v45.47,14.22 45.09,14.61 45.09,15.87 44.45,16.51 42.55,16.51 38.73,20.32 38.73,23.9 35.61,26.72 35.51,26.82 v33.83,26.82
N$11
  Top 0.152: IC1.6 52.39,11.75 53.34,12.7 53.34,15.46 R34.1 47.46,16.72 46.74,16 46.74,12.7 45.21,11.43 44.2,11.43 41.7,8.68 R36.2 41.7,3.81 R35.2
N$12  (via drill 0.3)
  Top 0.152: 39.49,10.44 R16.2 39.37,9.53 40.01,8.89 40.01,5.08 40.39,4.7 40.39,2.04 38.6,0.25 24.13,0.25 23.88,0.51 v23.88,2.54 | v30.02,28.67 30.02,29.21 29.13,30.1 28.41,30.1 IC5.1 | v20.19,26.17 v26.45,26.17
  Bottom 0.152: v30.02,28.67 28.95,28.67 v26.45,26.17 | v20.19,26.17 6.43,12.41 R18.1 6.25,12.23 5,10.98 5,5.97 8.58,2.4 23.76,2.4 v23.88,2.54
N$13  (via drill 0.3)
  Top 0.152: v29.31,27.06 29.31,29.21 28.95,29.56 28.41,29.56 IC5.2
  Bottom 0.152: R18.2 6.25,10.44 6.25,9.91 5.36,9.01 5.36,6.15 5.54,5.97 7.15,5.97 8.04,6.87 8.04,9.73 8.76,10.44 R17.1 8.94,10.62 12.33,14.02 12.33,15.98 17.87,21.52 25.2,21.52 29.31,25.63 v29.31,27.06
N$14  (via drill 0.3)
  Top 0.152: v6.97,9.55 7.5,9.01 8.22,9.01 v8.76,9.55 | v27.16,29.03 28.23,29.03 IC5.3 | v22.34,27.78 v25.2,27.78
  Bottom 0.152: v8.76,9.55 8.76,8.48 R14.1 | R15.2 6.43,8.48 6.43,9.01 v6.97,9.55 7.33,9.91 7.33,12.23 22.34,27.24 v22.34,27.78 | v27.16,29.03 26.45,29.03 v25.2,27.78
N$15  (via drill 0.3)
  Top 0.152: v23.59,31.17 24.12,30.64 29.13,30.64 30.74,29.03 32.52,29.03 IC5.6 | v21.09,30.99 21.09,31.35 17.33,35.1 17.33,36.89 16.62,37.6 16.62,39.21 v16.08,39.75
  Bottom 0.152: R23.2 6.43,42.43 8.04,44.04 8.04,44.75 8.22,44.93 9.47,44.93 9.83,44.57 9.83,43.32 8.94,42.43 R22.1 8.76,42.25 8.04,41.54 8.04,39.57 8.22,39.39 9.65,39.39 10.01,39.75 v16.08,39.75 | v23.59,31.17 22.87,31.89 21.98,31.89 v21.09,30.99
N$16  (via drill 0.3)
  Top 0.152: v33.77,28.13 32.7,28.13 IC5.5 | v31.99,30.99 30.91,30.99 v30.2,31.71 | v26.98,27.6 25.91,27.6 25.38,27.06 v18.05,27.06
  Bottom 0.152: 5.36,40.28 6.25,40.28 R20.2 | 5.36,40.28 4.65,41 4.65,43.86 6.08,45.29 9.65,45.29 10.19,44.75 10.19,41.54 8.94,40.28 R19.1 | v33.77,28.13 33.77,29.21 v31.99,30.99 | v30.2,31.71 29.48,31.71 27.88,30.1 27.88,28.49 v26.98,27.6 | v18.05,27.06 12.51,27.06 5.36,34.21 5.36,40.28
N$17  (via drill 0.3)
  Top 0.152: R38.2 28.57,6.35 v29.84,6.99 | v42.42,5.08 45.09,5.08 46.35,6.35 46.35,6.48 47.24,7.37 47.24,7.87 47.62,8.25 47.62,9.27 47.5,9.4 45.85,9.4 v45.72,9.53
  Bottom 0.152: R41.1 47.93,12.79 IC7.2 47.93,11.1 46.35,9.53 v45.72,9.53 | v29.84,6.99 39.37,6.99 41.27,5.08 v42.42,5.08
N$18
  Bottom 0.152: R24.2 43.24,7.94 43.24,6.51 45.57,4.19 R25.1
N$19
  Bottom 0.152: R25.2 45.75,2.4 48.61,2.4 49.86,3.65 R26.1 49.86,3.83 49.32,4.37 49.32,7.94 IC7.5
N$20
  Bottom 0.152: 52.18,11.51 54.5,9.19 54.5,7.23 R27.1 | 52.18,11.51 52.18,12.94 R28.2 | 52.18,11.51 51.47,11.51 48.61,8.65 48.61,8.12 IC7.6
N$21
  Bottom 0.152: R29.2 54.5,10.62 53.07,12.05 53.07,13.84 52.18,14.73 R28.1 52,14.73 51.11,13.84 51.11,12.76 48.07,9.73 48.07,8.12 IC7.7
N$22
  Bottom 0.152: R29.1 54.5,12.41 54.5,14.91 54.33,15.09 54.33,17.41 56.11,19.2 56.11,19.74 IC9.3
N$23  (via drill 0.3)
  Top 0.152: R11.2 27.52,8.04 26.67,8.89 U$4.8 | R12.2 26.67,1.87 26.67,3.81 26.92,4.06 26.92,7.11 27.85,8.04 R11.2 | R11.2 28.16,8.25 v30.48,8.25 | v43.81,4.44 45.72,4.44 46.99,5.71 46.99,6.6 47.79,7.4 R4.1
  Bottom 0.152: v30.48,8.25 31.11,7.62 39.37,7.62 41.27,5.71 43.18,5.71 43.81,5.08 v43.81,4.44
N$24
  Top 0.152: U$10.A 15.9,8.65 15.91,8.67
  pour Top: 21.59,8.89 2.54,8.89 2.54,0 13.34,0 13.34,8.25 21.59,8.25
N$25
  Top 0.152: R13.2 5.98,27.15 U$5.2
N$26
  Top 0.406: 2.54,38.1 2.54,36.83 6.24,34.4 U$5.6
  Top 2.54: 2.54,38.1 2.54,41.8 0.47UH.1
N$27
  Top 0.152: C1.2 49.96,15.03 R34.2
N$28  (via drill 0.3)
  Top 0.152: R39.2 32.09,10.44 R40.1 33.69,10.2 v33.66,10.16
  Bottom 0.152: v33.66,10.16 40.64,10.16 41.91,8.89 46.35,8.89 48.58,11.12 IC7.3
N$29  (via drill 0.3)
  Top 0.152: v55.88,27.94 56.3,27.52 56.73,27.52 57.15,27.94 59.91,27.94 R1.1 | v53.98,30.48 51.13,30.48 Q2.1
  Bottom 0.152: v55.88,27.94 55.88,28.57 v53.98,30.48
N$30
  Top 0.152: R45.2 4.41,27.69 5.08,27.69 5.48,28.09 U$5.1
N$31  (via drill 0.3)
  Top 0.152: Q3.1 50.57,33.5 52.07,32 54.86,32 55.24,32.39 55.24,34.04 v57.4,36.19 | v57.78,30.48 R2.1
  Bottom 0.152: v57.4,36.19 57.4,30.86 v57.78,30.48
N$37  (via drill 0.3)
  Top 0.152: R3.1 53.34,20.96 v53.98,21.59
  Bottom 0.152: v53.98,21.59 53.98,22.86 52.07,24.76 52.07,37.46 50.8,38.73 50.8,40.97 Q4.1
N$45  (via drill 0.3)
  Top 0.152: U$7.1 52.9,33.86 v52.9,32.6
  Bottom 0.152: v52.9,32.6 52.9,25.99 54.86,24.02 54.86,19.91 IC9.1
N$48
  Top 0.152: C14.1 22.52,22.77 23.95,22.77 24.12,22.59 Q1.2 24.3,22.42 25.15,22.4 25.5,22.4 26.82,21.08 27.85,21.08 U$6.5
N$50
  Top 0.152: C15.1 22.52,20.45 23.95,20.45 24.12,20.63 Q1.1 24.3,20.63 26.62,20.63 26.95,20.29 27.82,20.29 U$6.6
RST/SBWTDIO  (via drill 0.3)
  Top 0.152: v15.24,14.61 15.24,16.51 JP7.1 11.52,20.18 R46.2 | v24.13,15.24 24.13,19.05 24.79,19.71 27.88,19.71 U$6.7
  Bottom 0.152: v24.13,15.24 20.32,11.43 18.41,11.43 v15.24,14.61
SC+  (via drill 0.3)
  Top 0.152: v35.74,39.39 33.95,39.39 33.42,38.86 32.88,38.86 U$3.4
  Top 1.27: JP1.6 JP1.5 25.4,41.91 27.79,39.52
  Top 1.676: R8.1 27.79,39.52
  Bottom 0.152: v35.74,39.39 35.74,41.36 34.13,42.97 34.13,46.18 33.42,46.9 26.63,46.9 25.55,45.83 JP1.6
TEST/SBWTCK
  Top 0.152: JP7.2 12.15,23.36 12.51,24.02 26.14,24.02 26.54,23.63 U$6.1
V_BT_MS
  Top 0.152: C7.2 42.17,16.34 41.99,16.16 39.49,16.16 R21.1 39.31,16.16 38.55,16.16 37.67,17.04 35.69,17.04 U$6.28
V_BUS_MS
  Top 0.152: 39.49,12.41 41.99,12.41 42.17,12.59 C6.2 | 39.49,12.41 R16.1 | 39.49,12.41 38.92,12.41 36.83,14.5 36.83,16.18 36.47,16.54 35.66,16.54 U$6.27
VCC  (via drill 0.3)
  Top 0.152: 22.7,33.85 24.84,33.85 27.7,30.99 v29.66,30.99 30.38,30.99 31.09,30.28 32.52,30.28 IC5.8 32.7,30.1 33.75,30.1 35.02,28.62 | 22.7,33.85 21.62,33.85 U$2.3 | 22.7,33.85 v22.7,31.17 | C_IC5.2 31.45,26.17 34.28,26.17 35.35,27.49 35.35,28.24 35.02,28.62 | 35.02,28.62 v35.56,28.67 | U$2.4 21.62,36 23.23,36 23.59,36.35 R6.1 | 30.48,38.1 31.09,38.14 32.7,38.14 U$3.5 32.88,38.14 33.24,38.14 33.77,38.68 34.49,38.68 U$3.3 | 10.01,9.55 v10.01,7.94 | v25.92,17.05 25.99,15.21 | 25.99,15.21 26.17,14.91 | v19.66,12.44 19.66,12.05 | 25.99,15.21 26.04,15.24 C21.2 26.12,14.73 26.39,14.73 27.23,13.89 27.89,13.89 U$6.16 | v55.88,17.78 v48.26,17.78 48.01,18.03 v38.86,18.03 | v47.62,21.59 47.62,22.86 | v46.35,7.62 45.09,8.89 v45.09,10.16 45.97,10.16 46.61,10.79 50.67,10.79 IC1.8 | v41.66,10.41 41.66,9.91 40.64,8.89 40.64,5.71 41.27,5.08 41.27,1.9 42.55,0.63 48.05,0.63 48.68,1.27 50.16,1.27 50.59,1.69 R5.1 | C_IC1.2 56.39,7.96 56.39,6.1 56.13,5.84 v56.13,5.59 | VCC.1 41.91,26.67 43.18,25.4 | 58.42,34.92 U$7.2 | U$5.3 6.49,26.11 R13.1 7.31,25.29 9.7,25.29 | R46.1 9.14,23.75 8.89,24 | v29.21,20.32 29.21,22.86 27.94,22.86 U$6.2
  Top 0.254: U$4.3 20.2,8.89 C4.2 | U$5.3 U$5.4
  Top 1.27: R6.1 R8.2 28.09,36.83 29.21,36.83 30.48,38.1 30.48,39.37 31.75,40.64 36.32,40.64 37.59,39.37 38.1,39.37 40.64,36.83 40.64,34.92 43.18,32.39 43.18,25.4 43.18,24.13 44.45,22.86 47.62,22.86 52.7,22.86 53.98,24.13 53.98,27.94 58.17,33.15 58.17,33.8 U$7.2 | 5.18,12.6 1.27,16.51 1.27,24 8.89,24 9.7,25.29 10.16,26.04 15.24,26.04 17.14,27.94 17.14,31.11 13.34,34.92 | 58.42,34.92 59.69,34.92 60.96,36.19 60.96,47.62 60.33,48.26 15.88,48.26
  Top 1.676: 10UH.1 5.18,12.6
  Bottom 0.152: v22.7,31.17 22.7,29.92 R81.1 | v29.66,30.99 29.66,29.92 R80.1 | R79.1 35.92,29.74 35.92,29.03 v35.56,28.67 35.56,28.57 45.72,18.42 45.72,16.51 46.99,16.51 v48.26,17.78 47.62,18.42 v47.62,21.59 | 55.58,16.87 58.44,16.87 | 58.44,16.87 59.69,16.87 C_IC9.2 | 55.58,16.87 55.04,16.34 55.04,15.8 IC9.8 | 58.44,16.87 58.44,12.05 58.61,11.87 59.15,11.87 60.04,10.98 60.04,9.37 59.86,9.19 58.61,9.19 57.54,8.12 57.54,7.76 U$19.3 57.57,7.49 C27.2 56.64,5.08 v56.13,5.59 | v10.01,7.94 8.94,6.87 R14.2 | FERRITE_BEAD.2 24.3,17.05 v25.92,17.05 26.04,17.14 v29.21,20.32 | 43.78,13.12 C_IC7.2 | R24.1 43.24,9.91 43.24,12.41 43.78,12.94 C_IC7.2 | 19.66,13.84 v19.66,12.44 | 19.66,13.84 22.87,17.05 24.12,17.05 FERRITE_BEAD.2 | 55.58,16.87 55.51,16.87 55.24,17.14 v55.88,17.78 | R24.1 44.66,9.74 v45.09,10.16 | v46.35,7.62 46.86,7.62 IC7.8 | v41.66,10.41 42.33,9.74 R24.1 | C_IC7.2 43.78,13.12 v38.86,18.03 | C24.+ 19.47,19.79 C22.1 18.49,16.8 18.49,15 19.66,13.84 | FERRITE_BEAD.2 FERRITE_BEAD.1
  pour Top: 8.89,48.89 8.89,32.39 12.06,32.39 12.06,34.29 16.51,34.29 16.51,48.89
  pour Top: 20.95,8.89 20.32,8.25 20.32,9.53 2.54,9.53 2.54,15.09 11.43,15.09 11.43,12.07 19.68,12.07
VREF  (via drill 0.3)
  Top 0.152: R40.2 35.56,8.6 v35.56,6.1 | IC1.5 53.47,10.79 v56.52,10.79 56.52,18.42 VREF.1 | R31.2 46.01,1.27 v44.45,1.27
  Bottom 0.152: U$19.4 57.36,10.08 56.83,9.55 56.83,7.76 54.68,5.62 R27.2 54.61,1.27 53.72,0.38 43.56,0.38 | C28.2 57.54,12.59 57.54,10.26 U$19.4 | 43.56,0.38 36.83,0.38 35.56,1.9 v35.56,6.1 | v56.52,10.79 57.12,10.19 U$19.4 | v44.45,1.27 43.56,0.38

### Text on the board
tPlace: BT+ | GND | SC+ | GND | EXT1 | EXT2 | EXT3 | GND | HEAT_BUS | DISSIP | HT1 | HT2 | HT3 | GND | TEST | SCL | RST | SDA | AN1 | AN2 | AN3 | AN4
bNames: Octanis_EPS v0.3